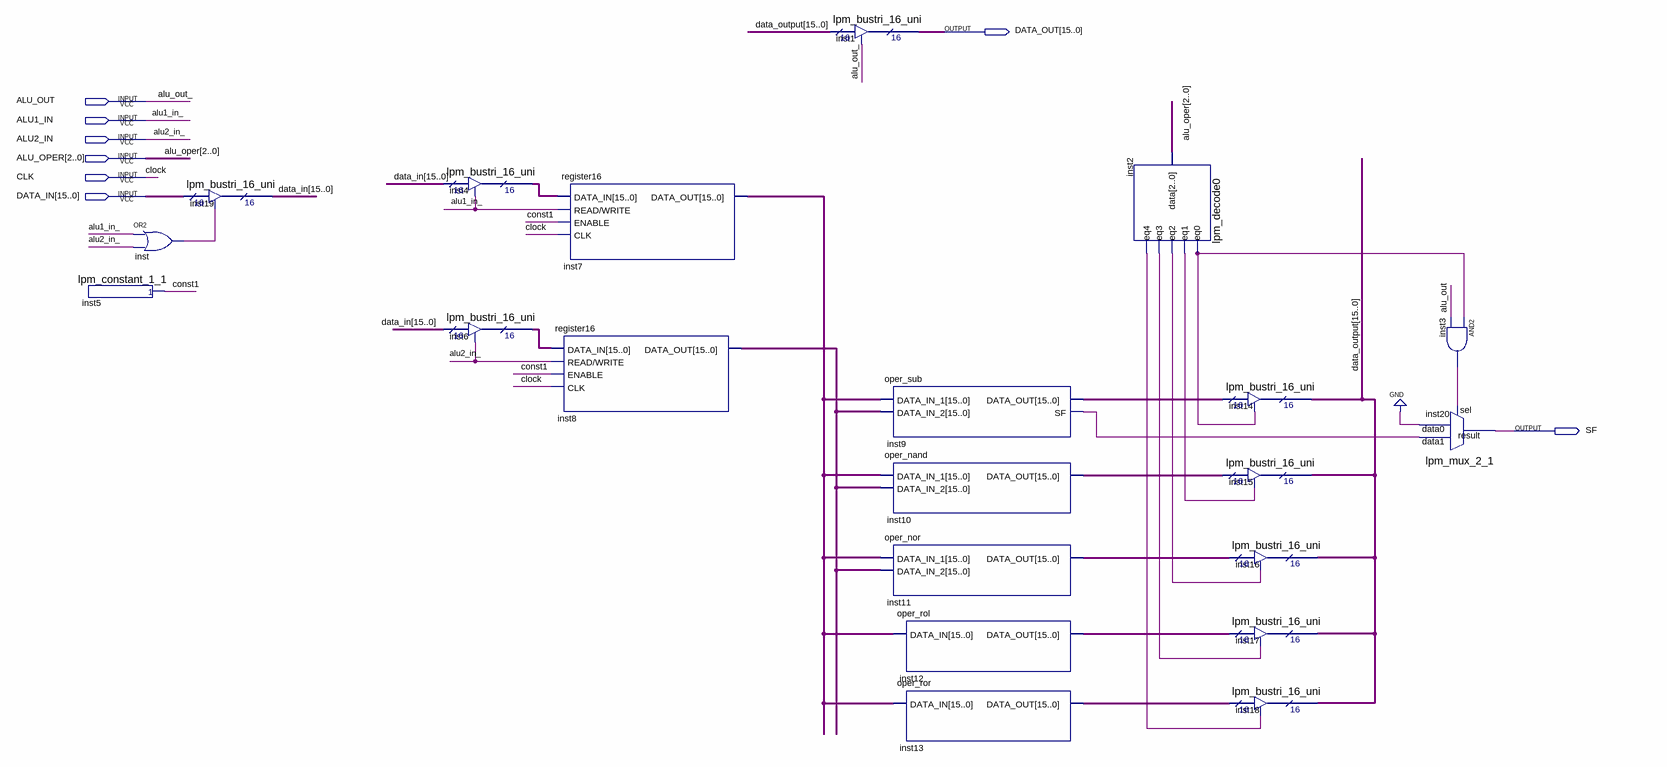
[diagram p0: schematic sheet]
// Quartus schematic alu_block.bdf as structural Verilog: 21 symbols, 8 pins
module alu_block (
  input  ALU_OUT,
  input  ALU1_IN,
  input  ALU2_IN,
  input  [2:0] ALU_OPER,
  input  CLK,
  input  [15:0] DATA_IN,
  output [15:0] DATA_OUT,
  output SF
);

  wire const1, inst2_eq0, inst2_eq1, inst2_eq2, inst2_eq3, inst2_eq4, inst3_out, inst9_sf, inst_out;
  wire [15:0] data_output, inst4_tridata, inst6_tridata, inst7_data_out, inst8_data_out, inst9_data_out,
       inst10_data_out, inst11_data_out, inst12_data_out, inst13_data_out;

  lpm_constant_1_1 inst5 (.result(const1));
  or inst (inst_out, ALU1_IN, ALU2_IN);
  lpm_bustri_16_uni inst19 (.enabledt(inst_out), .data(DATA_IN), .tridata(DATA_IN));
  lpm_bustri_16_uni inst4 (.enabledt(ALU1_IN), .data(DATA_IN), .tridata(inst4_tridata));
  lpm_bustri_16_uni inst6 (.enabledt(ALU2_IN), .data(DATA_IN), .tridata(inst6_tridata));
  register16 inst7 (
    .DATA_IN(inst4_tridata), .\READ/WRITE (ALU1_IN), .ENABLE(const1), .CLK(CLK), .DATA_OUT(inst7_data_out));
  register16 inst8 (
    .DATA_IN(inst6_tridata), .\READ/WRITE (ALU2_IN), .ENABLE(const1), .CLK(CLK), .DATA_OUT(inst8_data_out));
  lpm_bustri_16_uni inst1 (.enabledt(ALU_OUT), .data(data_output), .tridata(DATA_OUT));
  oper_sub inst9 (.DATA_IN_1(inst7_data_out), .DATA_IN_2(inst8_data_out), .DATA_OUT(inst9_data_out), .SF(inst9_sf));
  oper_nand inst10 (.DATA_IN_1(inst7_data_out), .DATA_IN_2(inst8_data_out), .DATA_OUT(inst10_data_out));
  oper_nor inst11 (.DATA_IN_1(inst7_data_out), .DATA_IN_2(inst8_data_out), .DATA_OUT(inst11_data_out));
  oper_rol inst12 (.DATA_IN(inst7_data_out), .DATA_OUT(inst12_data_out));
  oper_ror inst13 (.DATA_IN(inst7_data_out), .DATA_OUT(inst13_data_out));
  lpm_decode0 inst2 (
    .data(ALU_OPER), .eq0(inst2_eq0), .eq1(inst2_eq1), .eq2(inst2_eq2), .eq3(inst2_eq3), .eq4(inst2_eq4));
  lpm_bustri_16_uni inst14 (.enabledt(inst2_eq0), .data(inst9_data_out), .tridata(data_output));
  lpm_bustri_16_uni inst15 (.enabledt(inst2_eq1), .data(inst10_data_out), .tridata(data_output));
  lpm_bustri_16_uni inst16 (.enabledt(inst2_eq2), .data(inst11_data_out), .tridata(data_output));
  lpm_bustri_16_uni inst17 (.enabledt(inst2_eq3), .data(inst12_data_out), .tridata(data_output));
  lpm_bustri_16_uni inst18 (.enabledt(inst2_eq4), .data(inst13_data_out), .tridata(data_output));
  lpm_mux_2_1 inst20 (.data1(inst9_sf), .data0(1'b0), .sel(inst3_out), .result(SF));
  and inst3 (inst3_out, inst2_eq0, ALU_OUT);

  // Other names for the same wires on the sheet: alu1_in_ = ALU1_IN; alu2_in_ = ALU2_IN; alu_out_ = ALU_OUT;
  //   clock = CLK
endmodule
